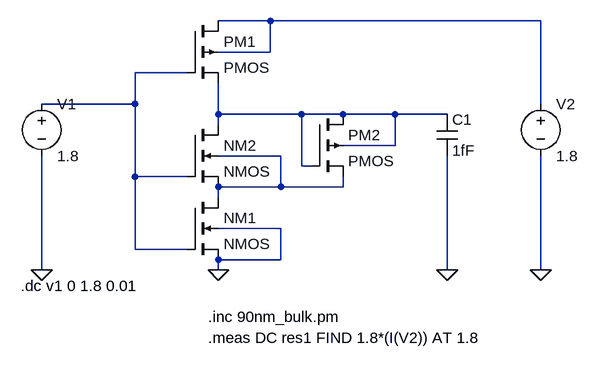
[diagram p0: schematic staticpowerproposed@1.8.asc]
staticpowerproposed@1.8.asc, the LTspice schematic file:
Version 4
SHEET 1 880 680
WIRE 208 -64 128 -64
WIRE 624 -64 208 -64
WIRE 208 -16 208 -64
WIRE 208 -16 128 -16
WIRE 80 16 0 16
WIRE 0 64 0 16
WIRE 0 64 -144 64
WIRE 624 64 624 -64
WIRE 128 80 128 32
WIRE 256 80 128 80
WIRE 320 80 256 80
WIRE 400 80 320 80
WIRE 480 80 400 80
WIRE 128 96 128 80
WIRE 400 128 400 80
WIRE 400 128 320 128
WIRE 224 144 128 144
WIRE 256 160 256 80
WIRE 272 160 256 160
WIRE 0 176 0 64
WIRE 80 176 0 176
WIRE 224 192 224 144
WIRE 224 192 128 192
WIRE 320 192 320 176
WIRE 320 192 224 192
WIRE 128 208 128 192
WIRE 224 256 128 256
WIRE 0 288 0 176
WIRE 80 288 0 288
WIRE 224 304 224 256
WIRE 224 304 128 304
WIRE -144 320 -144 144
WIRE 128 320 128 304
WIRE 480 320 480 144
WIRE 624 320 624 144
FLAG -144 320 0
FLAG 128 320 0
FLAG 480 320 0
FLAG 624 320 0
SYMBOL nmos4 80 208 R0
SYMATTR InstName NM1
SYMATTR Value2 l=100n w=45n
SYMBOL nmos4 80 96 R0
SYMATTR InstName NM2
SYMATTR Value2 l=100n w=45n
SYMBOL pmos4 80 -64 R0
SYMATTR InstName PM1
SYMATTR Value2 l=100n w=75n
SYMBOL pmos4 272 80 R0
SYMATTR InstName PM2
SYMATTR Value2 l=100n w=75n
SYMBOL voltage -144 48 R0
SYMATTR InstName V1
SYMATTR Value 1.8
SYMBOL voltage 624 48 R0
SYMATTR InstName V2
SYMATTR Value 1.8
SYMBOL cap 464 80 R0
SYMATTR InstName C1
SYMATTR Value 1fF
TEXT -176 344 Left 2 !.dc v1 0 1.8 0.01
TEXT 112 392 Left 2 !.inc 90nm_bulk.pm
TEXT 112 424 Left 2 !.meas DC res1 FIND 1.8*(I(V2)) AT 1.8

The netlist it stands for:
* staticpowerproposed@1.8.asc
M§NM1 N004 N002 0 0 NMOS l=100n w=45n
M§NM2 N003 N002 N004 N004 NMOS l=100n w=45n
M§PM1 N001 N002 N003 N001 PMOS l=100n w=75n
M§PM2 N003 N003 N004 N003 PMOS l=100n w=75n
V1 N002 0 1.8
V2 N001 0 1.8
C1 N003 0 1fF
.model NMOS NMOS
.model PMOS PMOS
.lib standard.mos
.dc v1 0 1.8 0.01
.inc 90nm_bulk.pm
.meas DC res1 FIND 1.8*(I(V2)) AT 1.8
.backanno
.end